# Altium schematic sheet 循迹壁障测速原理图.SchDoc
size A3
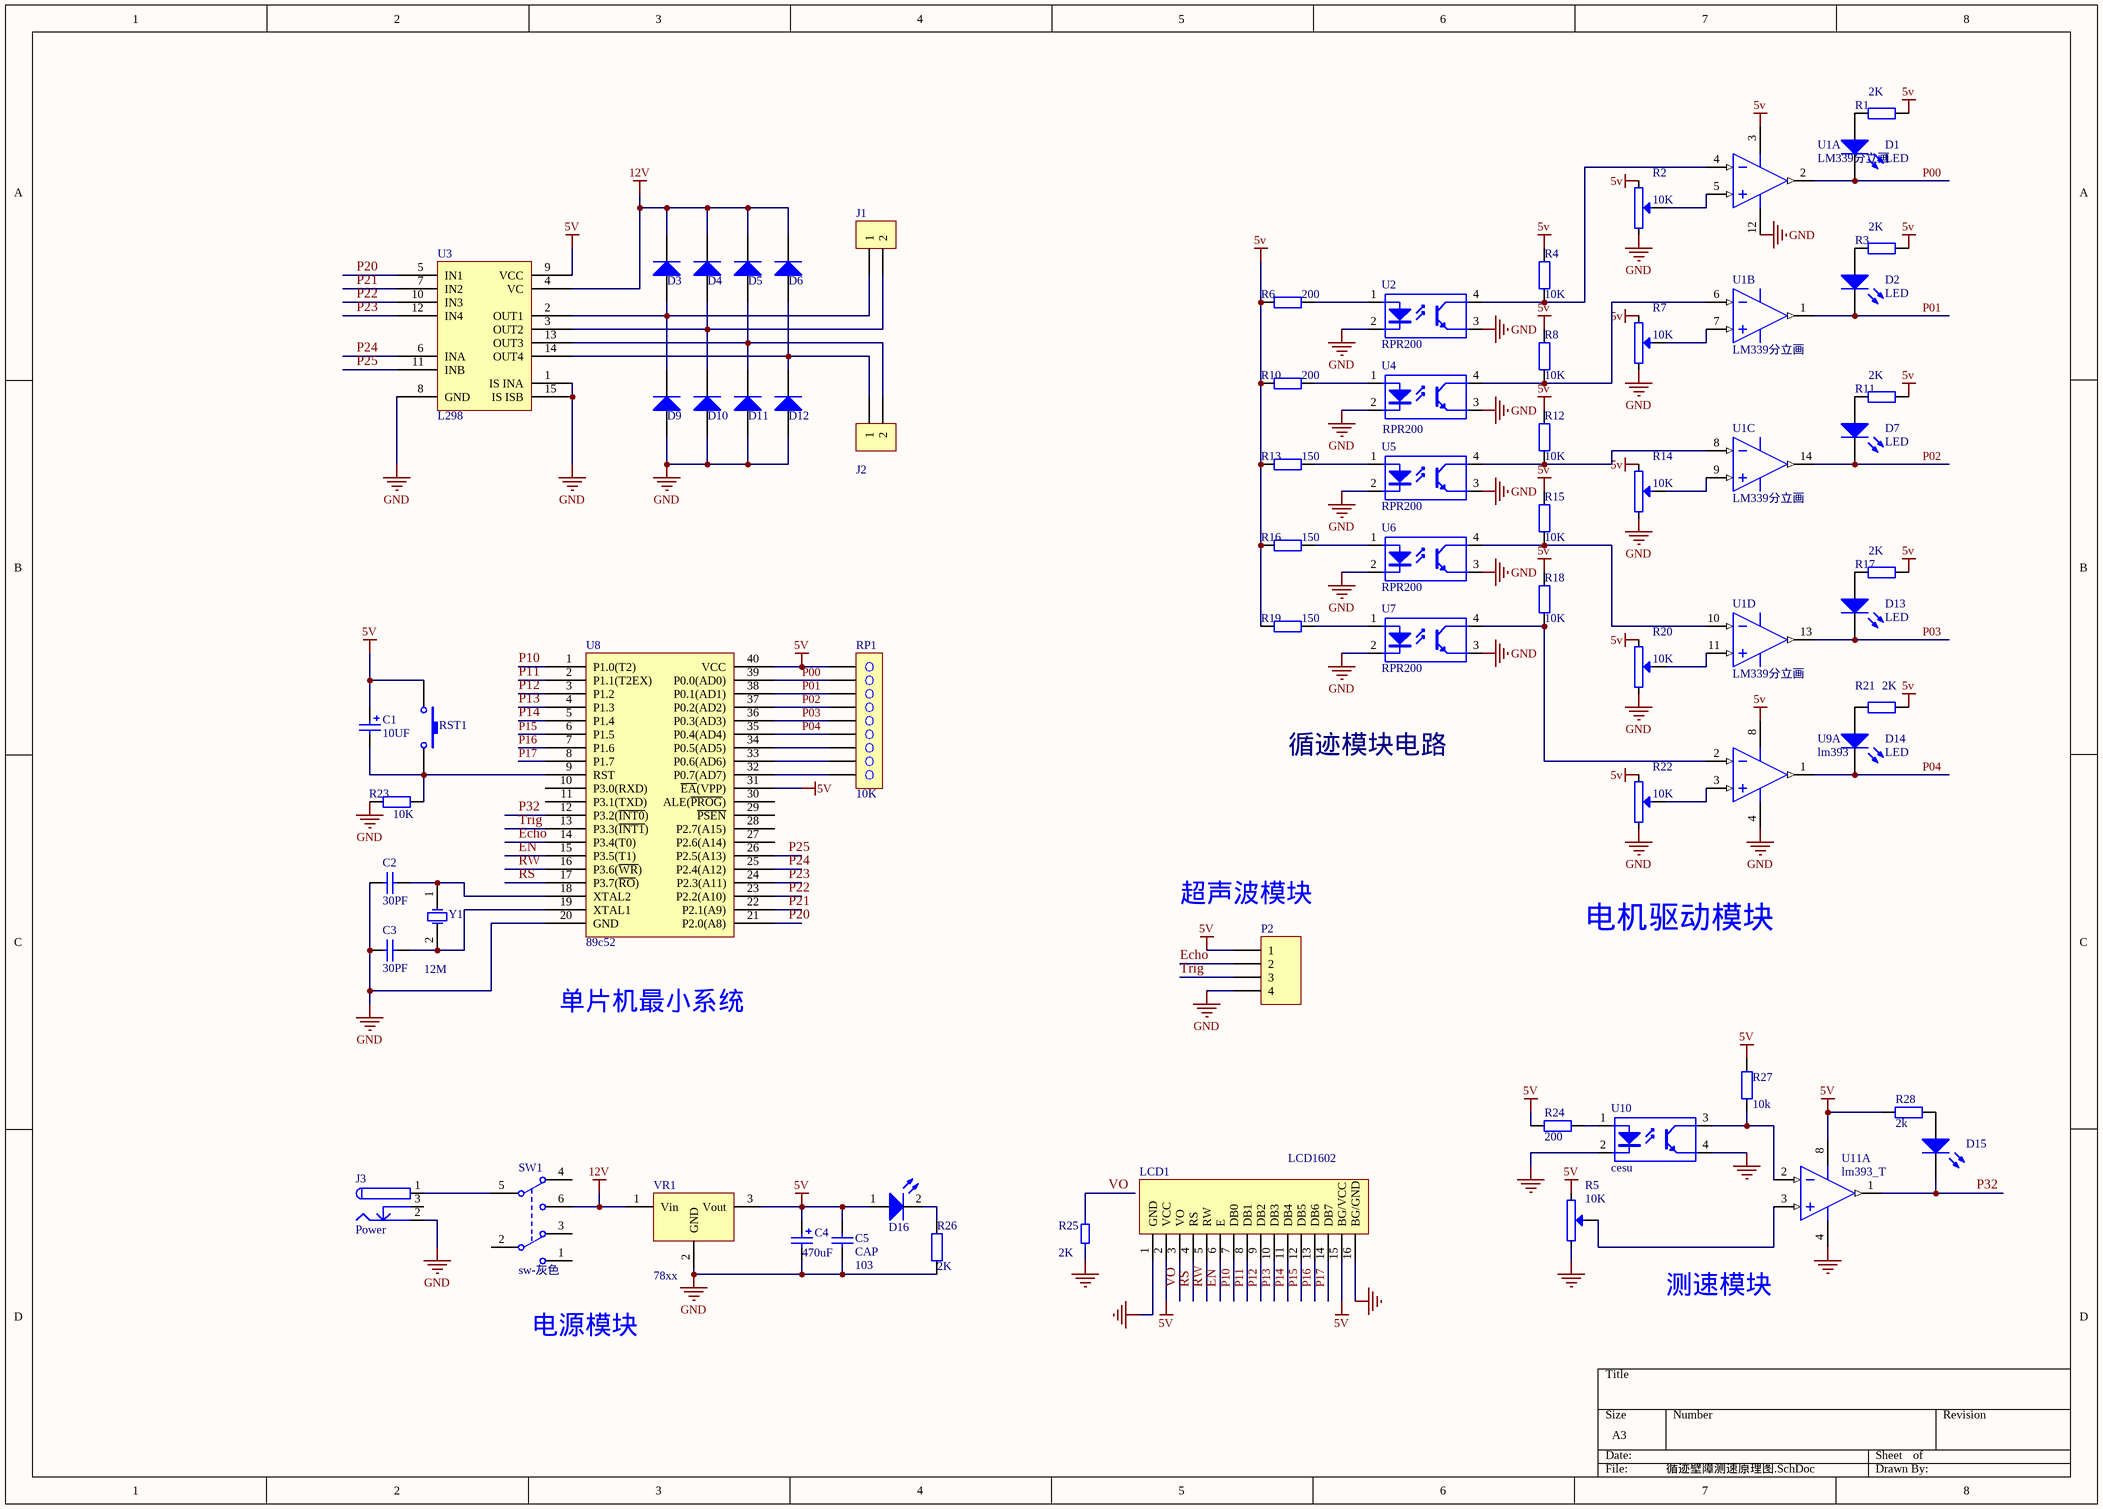
[diagram p0: 循迹壁障测速原理图.SchDoc]

## Parts
C1  value 10UF  [CR4.2]  (hidden comment: Cap Pol2)
C2  value 30PF  [CAP CP]  (hidden comment: CAP)
C3  value 30PF  [CAP CP]  (hidden comment: CAP)
C4  value 470uF  [CAP-3-8]  (hidden comment: CAP 470uF)
C5  CAP  value 103  [CAP CP]
D1  LED  [0805R]
D2  LED  [0805R]
D3  Diode-M4  [1N4007]  (value not drawn)
D4  Diode-M4  [1N4007]  (value not drawn)
D5  Diode-M4  [1N4007]  (value not drawn)
D6  Diode-M4  [1N4007]  (value not drawn)
D7  LED  [0805R]
D9  Diode-M4  [1N4007]  (value not drawn)
D10  Diode-M4  [1N4007]  (value not drawn)
D11  Diode-M4  [1N4007]  (value not drawn)
D12  Diode-M4  [1N4007]  (value not drawn)
D13  LED  [0805R]
D14  LED  [0805R]
D15  LED贴片  [0805LED]  (value not drawn)
D16  D  [LED2J]  (value not drawn)
J1  JP2  [P2]  (value not drawn)
J2  JP2  [P2]  (value not drawn)
J3  Power  [POWER]
LCD1  LCD1602  [1602]
P2  Header 4  [HDR1X4]  (value not drawn)
R1  value 2K  [0805R]  (hidden comment: RES 1)
R2  value 10K  [RES KT]  (hidden comment: RES  KB)
R3  value 2K  [0805R]  (hidden comment: RES 1)
R4  value 10K  [0805R]  (hidden comment: RES 1)
R5  value 10K  [RES蓝白卧式可调]  (hidden comment: RES蓝白)
R6  value 200  [0805R]  (hidden comment: RES 1)
R7  value 10K  [RES KT]  (hidden comment: RES  KB)
R8  value 10K  [0805R]  (hidden comment: RES 1)
R10  value 200  [0805R]  (hidden comment: RES 1)
R11  value 2K  [0805R]  (hidden comment: RES 1)
R12  value 10K  [0805R]  (hidden comment: RES 1)
R13  value 150  [0805R]  (hidden comment: RES 1)
R14  value 10K  [RES KT]  (hidden comment: RES  KB)
R15  value 10K  [0805R]  (hidden comment: RES 1)
R16  value 150  [0805R]  (hidden comment: RES 1)
R17  value 2K  [0805R]  (hidden comment: RES 1)
R18  value 10K  [0805R]  (hidden comment: RES 1)
R19  value 150  [0805R]  (hidden comment: RES 1)
R20  value 10K  [RES KT]  (hidden comment: RES  KB)
R21  value 2K  [0805R]  (hidden comment: RES 1)
R22  value 10K  [RES KT]  (hidden comment: RES  KB)
R23  value 10K  [res400mil]  (hidden comment: RES)
R24  value 200  [0805R]  (hidden comment: RES 贴片)
R25  2K  [res400mil]
R26  value 2K  [立式]  (hidden comment: RES)
R27  value 10k  [0805R]  (hidden comment: RES 贴片)
R28  value 2k  [0805R]  (hidden comment: RES 贴片)
RP1  10K  [SIP9]
RST1  SW-PB  [Kk]  (value not drawn)
SW1  sw-灰色  [DIP6/1]
U1  LM339分立画  [DIP14贴片]  (parts A,B,C,D of 4)
U2  RPR200  [GK178光电]
U3  L298  [L298驱动]
U4  RPR200  [GK178光电]
U5  RPR200  [GK178光电]
U6  RPR200  [GK178光电]
U7  RPR200  [GK178光电]
U8  89c52  [DIP40]
U9  lm393  [DIP8贴片]  (part A of 2)
U10  cesu  [cesu]
U11  lm393_T  [DIP8贴片]  (part A of 2)
VR1  78xx  [TO-220-1]
Y1  12M  [CY]

## Nets
5V: C1.1 C4.1 C5.2 D16.1 LCD1.2(VCC) LCD1.15(BG/VCC) P2.1 R1.1 R2.1 R3.1 R4.2 R5.1 R6.1 R7.1 R8.2 R10.1 R11.1 R12.2 R13.1 R14.1 R15.2 R16.1 R17.1 R18.2 R19.1 R20.1 R21.1 R22.1 R24.2 R27.2 R28.2 RP1.1 RST1.1 U1.3(V+) U3.9(VCC) U8.31(~{EA}(VPP)) U8.40(VCC) U9.8(VDD) U11.8(VDD) VR1.3(Vout)
12V: D3.K D4.K D5.K D6.K SW1.6(NO1) U3.4(VC) VR1.1(Vin)
GND: C2.2 C3.2 C4.2 C5.1 D9.A D10.A D11.A D12.A J3.2 LCD1.1(GND) LCD1.16(BG/GND) P2.4 R2.2 R5.2 R7.2 R14.2 R20.2 R22.2 R23.2 R25.2 R26.1 U1.12(GND) U2.2(K) U2.3(E) U3.1(IS_INA) U3.8(GND) U3.15(IS_ISB) U4.2(K) U4.3(E) U5.2(K) U5.3(E) U6.2(K) U6.3(E) U7.2(K) U7.3(E) U8.20(GND) U9.4(GND) U10.2(K) U10.4(E) U11.4(GND) VR1.2(GND)
Echo: P2.2 U8.14(P3.4(T0))
EN: LCD1.6(E) U8.15(P3.5(T1))
P00: D1.2(K) RP1.2 U1.2(OUT1) U8.39(P0.0(AD0))
P01: D2.2(K) RP1.3 U1.1(OUT2) U8.38(P0.1(AD1))
P02: D7.2(K) RP1.4 U1.14(OUT3) U8.37(P0.2(AD2))
P03: D13.2(K) RP1.5 U1.13(OUT4) U8.36(P0.3(AD3))
P04: D14.2(K) RP1.6 U8.35(P0.4(AD4)) U9.1(OUT)
P10: LCD1.7(DB0) U8.1(P1.0(T2))
P11: LCD1.8(DB1) U8.2(P1.1(T2EX))
P12: LCD1.9(DB2) U8.3(P1.2)
P13: LCD1.10(DB3) U8.4(P1.3)
P14: LCD1.11(DB4) U8.5(P1.4)
P15: LCD1.12(DB5) U8.6(P1.5)
P16: LCD1.13(DB6) U8.7(P1.6)
P17: LCD1.14(DB7) U8.8(P1.7)
P20: U3.5(IN1) U8.21(P2.0(A8))
P21: U3.7(IN2) U8.22(P2.1(A9))
P22: U3.10(IN3) U8.23(P2.2(A10))
P23: U3.12(IN4) U8.24(P2.3(A11))
P24: U3.6(INA) U8.25(P2.4(A12))
P25: U3.11(INB) U8.26(P2.5(A13))
P32: D15.K U8.12(P3.2(~{INT0})) U11.1(OUT)
RS: LCD1.4(RS) U8.17(P3.7(~{RO}))
RW: LCD1.5(RW) U8.16(P3.6(~{WR}))
Trig: P2.3 U8.13(P3.3(~{INT1}))
VO: LCD1.3(VO) R25.1
NetC1_2: C1.2 R23.1 RST1.2 U8.9(RST)
NetC2_1: C2.1 U8.18(XTAL2) Y1.1(OSC1)
NetC3_1: C3.1 U8.19(XTAL1) Y1.2(OSC2)
NetD1_1: D1.1(A) R1.2
NetD2_1: D2.1(A) R3.2
NetD3_A: D3.A D9.K J1.1 U3.2(OUT1)
NetD4_A: D4.A D10.K J1.2 U3.3(OUT2)
NetD5_A: D5.A D11.K J2.2 U3.13(OUT3)
NetD6_A: D6.A D12.K J2.1 U3.14(OUT4)
NetD7_1: D7.1(A) R11.2
NetD13_1: D13.1(A) R17.2
NetD14_1: D14.1(A) R21.2
NetD15_A: D15.A R28.1
NetD16_2: D16.2 R26.2
NetJ3_1: J3.1 SW1.5(COMMON1)
NetR2_W: R2.W U1.5(+IN1)
NetR4_1: R4.1 U1.4(-IN1) U2.4(C)
NetR5_W: R5.W U11.3(IN1+)
NetR6_2: R6.2 U2.1(A)
NetR7_W: R7.W U1.7(IN2+)
NetR8_1: R8.1 U1.6(-IN2) U4.4(C)
NetR10_2: R10.2 U4.1(A)
NetR12_1: R12.1 U1.8(-IN3) U5.4(C)
NetR13_2: R13.2 U5.1(A)
NetR14_W: R14.W U1.9(+IN3)
NetR15_1: R15.1 U1.10(-IN4) U6.4(C)
NetR16_2: R16.2 U6.1(A)
NetR18_1: R18.1 U7.4(C) U9.2(IN1-)
NetR19_2: R19.2 U7.1(A)
NetR20_W: R20.W U1.11(+IN4)
NetR22_W: R22.W U9.3(IN1+)
NetR24_1: R24.1 U10.1(A)
NetR27_1: R27.1 U10.3(C) U11.2(IN1-)
NetRP1_7: RP1.7 U8.34(P0.5(AD5))
NetRP1_8: RP1.8 U8.33(P0.6(AD6))
NetRP1_9: RP1.9 U8.32(P0.7(AD7))

Not connected (* = marked no-connect by the designer): J3 3; SW1 1(NO2) 2(COMMON2) 3(NC2) 4(NC1); U8 10(P3.0(RXD)) 11(P3.1(TXD)) 27(P2.6(A14)) 28(P2.7(A15)) 29(~{PSEN}) 30(ALE(~{PROG}))

## Notes on the sheet
- 循迹模块电路
- (near P2) 超声波模块
- 电机驱动模块
- 单片机最小系统
- 测速模块
- (near SW1) 电源模块

## Library data of the parts
C1 = Cap Pol2: Polarized Capacitor (Axial); Published: 8-Jun-2000; LatestRevisionDate: 17-Jul-2002; LatestRevisionNote: Re-released for DXP Platform.; PackageReference: POLAR0.8; Publisher: Altium Limited
C2 C3 C5 = CAP: 瓷片电容
C4 = CAP 470uF: 220uF 470uF 外径8mm 引脚3mm
D1 D2 D7 D13 D14 = LED_1: 发光二极管
D3-D6 D9-D12 = Diode-M4: 贴片二极管4007
D15 = LED贴片: 贴片LED
J1 J2 = JP2: 2排针
P2 = Header 4: Header, 4-Pin; LatestRevisionDate: 17-Jul-2002; LatestRevisionNote: Re-released for DXP Platform.; Publisher: Altium Limited
R2 R7 R14 R20 R22 = RES  KB: 可调电位器
R5 = RES蓝白: 蓝白卧式可调电位器
R24 R27 R28 = RES 贴片: 贴片电阻0805
R25 = RES2
RP1 = CON9: Connector
RST1 = SW-PB: Switch; Published: 24-Mar-1999; LatestRevisionDate: 17-Jul-2002; LatestRevisionNote: Re-released for DXP Platform.; PackageReference: SPST-2; Publisher: Altium Limited
U2 U4-U7 = GK178
U3 = L298: 电机驱动
U8 = 89c52: 单片机
U10 = cesu: 测速光电对管 ITR9608
Y1 = XTAL: Crystal Oscillator; Published: 8-Jun-2000; LatestRevisionDate: 17-Jul-2002; LatestRevisionNote: Re-released for DXP Platform.; PackageReference: R38; Publisher: Altium Limited